# Altium schematic sheet ports.SchDoc
size A3
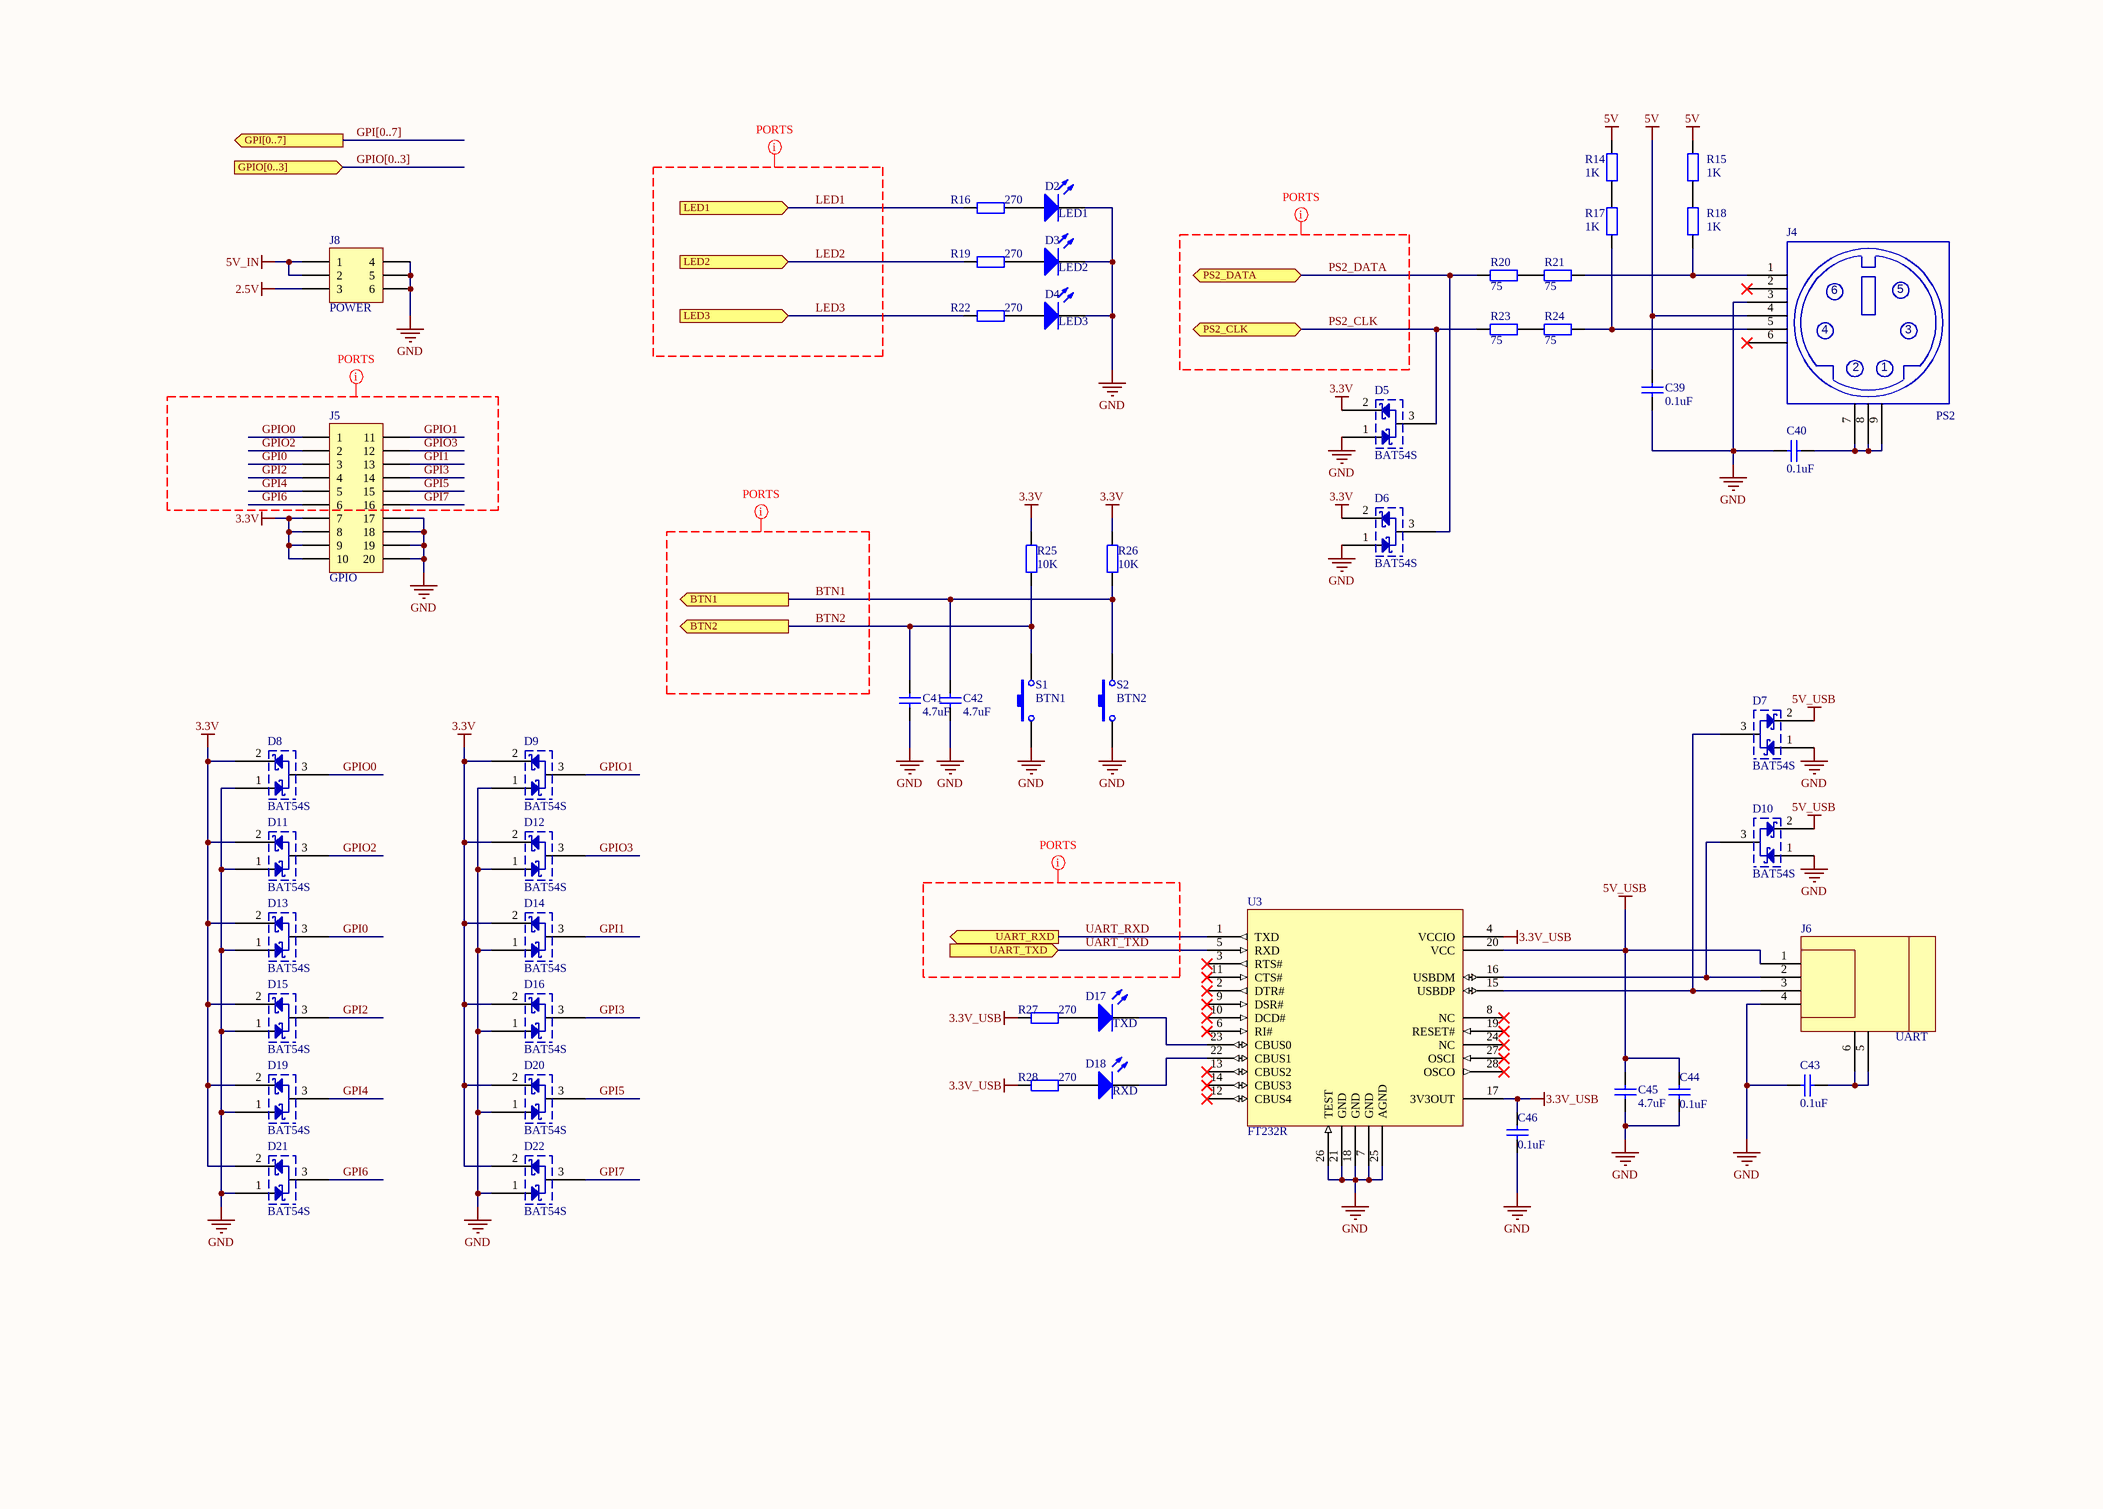
[diagram p0: ports.SchDoc]

## Parts
C39  value 0.1uF  [0402]  (hidden comment: Cap)
C40  value 0.1uF  [0402]  (hidden comment: Cap)
C41  value 4.7uF  [C0805]  (hidden comment: Cap)
C42  value 4.7uF  [C0805]  (hidden comment: Cap)
C43  value 0.1uF  [0402]  (hidden comment: Cap)
C44  value 0.1uF  [0402]  (hidden comment: Cap)
C45  value 4.7uF  [C0805]  (hidden comment: Cap)
C46  value 0.1uF  [0402]  (hidden comment: Cap)
D2  LED1  [LED]
D3  LED2  [LED]
D4  LED3  [LED]
D5  BAT54S  [SOT23_BAT54S]
D6  BAT54S  [SOT23_BAT54S]
D7  BAT54S  [SOT23_BAT54S]
D8  BAT54S  [SOT23_BAT54S]
D9  BAT54S  [SOT23_BAT54S]
D10  BAT54S  [SOT23_BAT54S]
D11  BAT54S  [SOT23_BAT54S]
D12  BAT54S  [SOT23_BAT54S]
D13  BAT54S  [SOT23_BAT54S]
D14  BAT54S  [SOT23_BAT54S]
D15  BAT54S  [SOT23_BAT54S]
D16  BAT54S  [SOT23_BAT54S]
D17  TXD  [LED]
D18  RXD  [LED]
D19  BAT54S  [SOT23_BAT54S]
D20  BAT54S  [SOT23_BAT54S]
D21  BAT54S  [SOT23_BAT54S]
D22  BAT54S  [SOT23_BAT54S]
J4  PS2  [PS2-6PIN]
J5  GPIO  [HDR2X10_CEN]
J6  UART  [USB_B]
J8  POWER  [HDR2X3_CEN]
R14  value 1K  [J1-0603]  (hidden comment: Res2)
R15  value 1K  [J1-0603]  (hidden comment: Res2)
R16  value 270  [6-0805_N]  (hidden comment: Res2)
R17  value 1K  [J1-0603]  (hidden comment: Res2)
R18  value 1K  [J1-0603]  (hidden comment: Res2)
R19  value 270  [6-0805_N]  (hidden comment: Res2)
R20  value 75  [J1-0603]  (hidden comment: Res2)
R21  value 75  [J1-0603]  (hidden comment: Res2)
R22  value 270  [6-0805_N]  (hidden comment: Res2)
R23  value 75  [J1-0603]  (hidden comment: Res2)
R24  value 75  [J1-0603]  (hidden comment: Res2)
R25  value 10K  [J1-0603]  (hidden comment: Res2)
R26  value 10K  [J1-0603]  (hidden comment: Res2)
R27  value 270  [6-0805_N]  (hidden comment: Res2)
R28  value 270  [6-0805_N]  (hidden comment: Res2)
S1  BTN1  [PUSHBUTTON]
S2  BTN2  [PUSHBUTTON]
U3  FT232R  [SSOP28]

## Ports
BTN1 (out), BTN2 (out), GPI[0..7] (out), GPIO[0..3] (in), LED1 (in), LED2 (in), LED3 (in), PS2_CLK (bidir), PS2_DATA (bidir), UART_RXD (out), UART_TXD (in)

## Nets
2.5V: J8.3
3.3V: D5.2 D6.2 D8.2 D9.2 D11.2 D12.2 D13.2 D14.2 D15.2 D16.2 D19.2 D20.2 D21.2 D22.2 J5.7 J5.8 J5.9 J5.10 R25.1 R26.1
3.3V_USB: C46.1 R27.2 R28.2 U3.4(VCCIO) U3.17(3V3OUT)
5V: C39.2 J4.4 R14.2 R15.2
5V_IN: J8.1 J8.2
5V_USB: C44.1 C45.2 D7.2 D10.2 J6.1 U3.20(VCC)
GND: C39.1 C40.1 C41.1 C42.1 C43.1 C44.2 C45.1 C46.2 D2.2(K) D3.2(K) D4.2(K) D5.1 D6.1 D7.1 D8.1 D9.1 D10.1 D11.1 D12.1 D13.1 D14.1 D15.1 D16.1 D19.1 D20.1 D21.1 D22.1 J4.3 J5.17 J5.18 J5.19 J5.20 J6.4 J8.4 J8.5 J8.6 S1.1 S2.1 U3.7(GND) U3.18(GND) U3.21(GND) U3.25(AGND) U3.26(TEST)
BTN1: C42.2 R26.2 S2.2 ; port BTN1
BTN2: C41.2 R25.2 S1.2 ; port BTN2
GPI0: D13.3 J5.3
GPI1: D14.3 J5.13
GPI2: D15.3 J5.4
GPI3: D16.3 J5.14
GPI4: D19.3 J5.5
GPI5: D20.3 J5.15
GPI6: D21.3 J5.6
GPI7: D22.3 J5.16
GPIO0: D8.3 J5.1
GPIO1: D9.3 J5.11
GPIO2: D11.3 J5.2
GPIO3: D12.3 J5.12
LED1: R16.2 ; port LED1
LED2: R19.2 ; port LED2
LED3: R22.2 ; port LED3
PS2_CLK: D5.3 R23.1 ; port PS2_CLK
PS2_DATA: D6.3 R20.1 ; port PS2_DATA
UART_RXD: U3.1(TXD) ; port UART_RXD
UART_TXD: U3.5(RXD) ; port UART_TXD
NetC40_2: C40.2 J4.7 J4.8 J4.9
NetC43_2: C43.2 J6.5 J6.6
NetD2_1: D2.1(A) R16.1
NetD3_1: D3.1(A) R19.1
NetD4_1: D4.1(A) R22.1
NetD7_3: D7.3 J6.3 U3.15(USBDP)
NetD10_3: D10.3 J6.2 U3.16(USBDM)
NetD17_1: D17.1(A) R27.1
NetD17_2: D17.2(K) U3.23(CBUS0)
NetD18_1: D18.1(A) R28.1
NetD18_2: D18.2(K) U3.22(CBUS1)
NetJ4_1: J4.1 R18.1 R21.2
NetJ4_5: J4.5 R17.1 R24.2
NetR14_1: R14.1 R17.2
NetR15_1: R15.1 R18.2
NetR20_2: R20.2 R21.1
NetR23_2: R23.2 R24.1

Not connected (* = marked no-connect by the designer): J4 2* 6*; U3 2(DTR#)* 3(RTS#)* 6(RI#)* 8(NC)* 9(DSR#)* 10(DCD#)* 11(CTS#)* 12(CBUS4)* 13(CBUS2)* 14(CBUS3)* 19(RESET#)* 24(NC)* 27(OSCI)* 28(OSCO)*

## Buses and harness runs
bus GPI[0..7] = port GPI[0..7]
bus GPIO[0..3] = port GPIO[0..3]

## Layout directives
net class PORTS: BTN1, BTN2, GPI0, GPI1, GPI2, GPI3, GPI4, GPI5, GPI6, GPI7, GPIO0, GPIO1, GPIO2, GPIO3, LED1, LED2, LED3, PS2_CLK, PS2_DATA, UART_RXD, UART_TXD

## Library data of the parts
C39-C46 = Cap: Capacitor; Published: 8-Jun-2000; LatestRevisionDate: 17-Jul-2002; LatestRevisionNote: Re-released for DXP Platform.; PackageReference: RAD-0.3; Publisher: Altium Limited; PackageDescription: Radial Cap, Thru-Hole; 2 Leads; 0.3 in Pin Spacing
D2-D4 = LED3: Amber; Published: 8-Jun-2000; LatestRevisionDate: 17-Dec-2003; LatestRevisionNote: PCB Footprint replaced.; DatasheetVersion: 16-Apr-2002; PackageVersion: 16-Apr-2002; PackageReference: 3.5X2.8X1.9; Publisher: Altium Limited; PackageDescription: SM LED; 2 C-Bend Leads; Body 3.5 x 2.8 x 1.9 mm, inc leads (LxWxH typ)
D17 = LED3: Green; Published: 8-Jun-2000; LatestRevisionDate: 17-Dec-2003; LatestRevisionNote: PCB Footprint replaced.; DatasheetVersion: 16-Apr-2002; PackageVersion: 16-Apr-2002; PackageReference: 3.5X2.8X1.9; Publisher: Altium Limited; PackageDescription: SM LED; 2 C-Bend Leads; Body 3.5 x 2.8 x 1.9 mm, inc leads (LxWxH typ)
D18 = LED3: Red; Published: 8-Jun-2000; LatestRevisionDate: 17-Dec-2003; LatestRevisionNote: PCB Footprint replaced.; DatasheetVersion: 16-Apr-2002; PackageVersion: 16-Apr-2002; PackageReference: 3.5X2.8X1.9; Publisher: Altium Limited; PackageDescription: SM LED; 2 C-Bend Leads; Body 3.5 x 2.8 x 1.9 mm, inc leads (LxWxH typ)
J4 = PS2_Socket
J5 = Header 10X2A: Header, 10-Pin, Dual row; LatestRevisionDate: 17-Jul-2002; LatestRevisionNote: Re-released for DXP Platform.; Publisher: Altium Limited
J6 = USB_B
J8 = Header 3X2A: Header, 3-Pin, Dual row; LatestRevisionDate: 17-Jul-2002; LatestRevisionNote: Re-released for DXP Platform.; Publisher: Altium Limited
R14-R28 = Res2: Resistor; Published: 8-Jun-2000; LatestRevisionDate: 17-Jul-2002; LatestRevisionNote: Re-released for DXP Platform.; PackageReference: AXIAL-0.4; Publisher: Altium Limited; PackageDescription: Axial Device, Thru-Hole; 2 Leads; 0.4 in Pin Spacing
S1 S2 = SW-PB: Switch; Published: 24-Mar-1999; LatestRevisionDate: 17-Jul-2002; LatestRevisionNote: Re-released for DXP Platform.; PackageReference: SPST-2; Publisher: Altium Limited; PackageDescription: Switch; 2 Leads